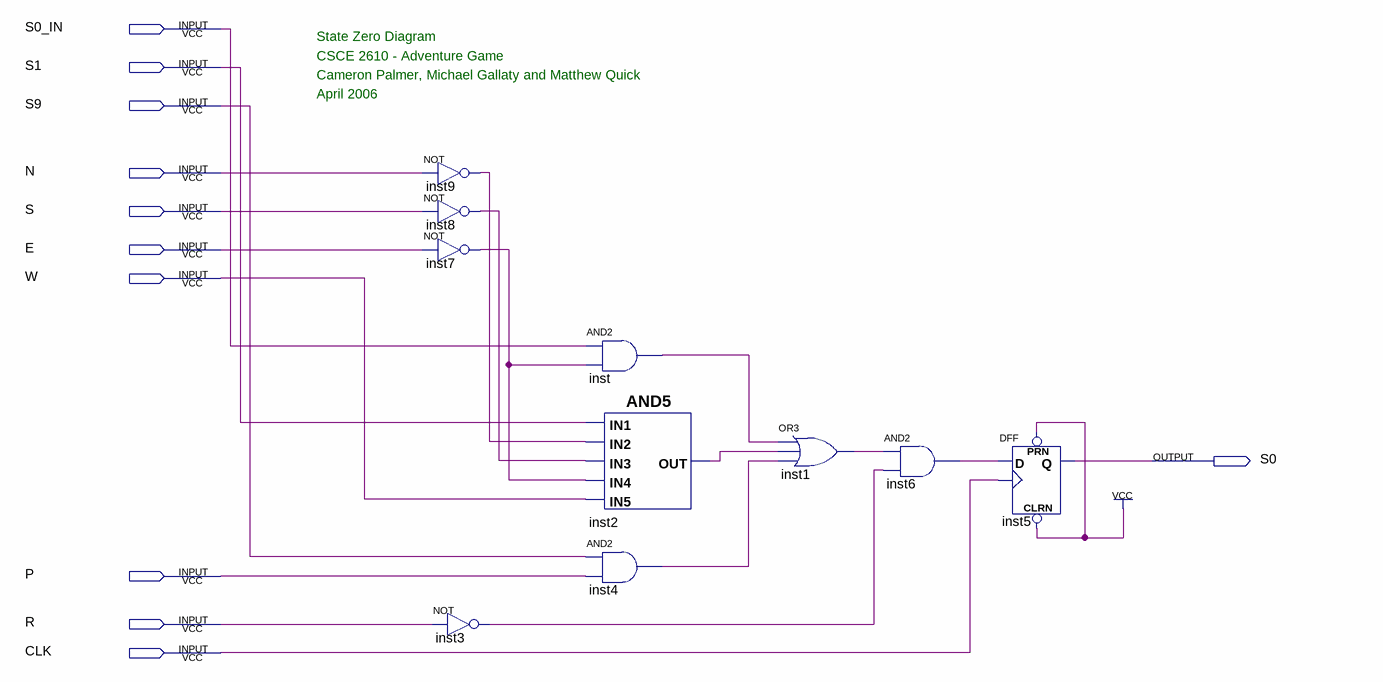
[diagram p0: schematic sheet]
// Quartus schematic state_zero.bdf as structural Verilog: 10 symbols, 11 pins
module state_zero (
  input  S0_IN,
  input  S1,
  input  S9,
  input  N,
  input  S,
  input  E,
  input  W,
  input  P,
  input  R,
  input  CLK,
  output S0
);

  wire inst1_out, inst2_out, inst3_out, inst4_out, inst6_out, inst7_out, inst8_out, inst9_out, inst_out;

  not inst9 (inst9_out, N);
  not inst8 (inst8_out, S);
  not inst7 (inst7_out, E);
  not inst3 (inst3_out, R);
  and inst (inst_out, S0_IN, inst7_out);
  and inst2 (inst2_out, S1, inst9_out, inst8_out, inst7_out, W);
  and inst4 (inst4_out, S9, P);
  or inst1 (inst1_out, inst_out, inst2_out, inst4_out);
  and inst6 (inst6_out, inst1_out, inst3_out);
  DFF inst5 (.CLRN(1'b1), .CLK(CLK), .D(inst6_out), .PRN(1'b1), .Q(S0));

  // Notes on the sheet:
  //   State Zero Diagram
  //   CSCE 2610 - Adventure Game
  //   Cameron Palmer, Michael Gallaty and Matthew Quick
  //   April 2006
endmodule
